# EAGLE design TMMOD-BREAKOUT-v1_1 (EAGLE 9.7.0)
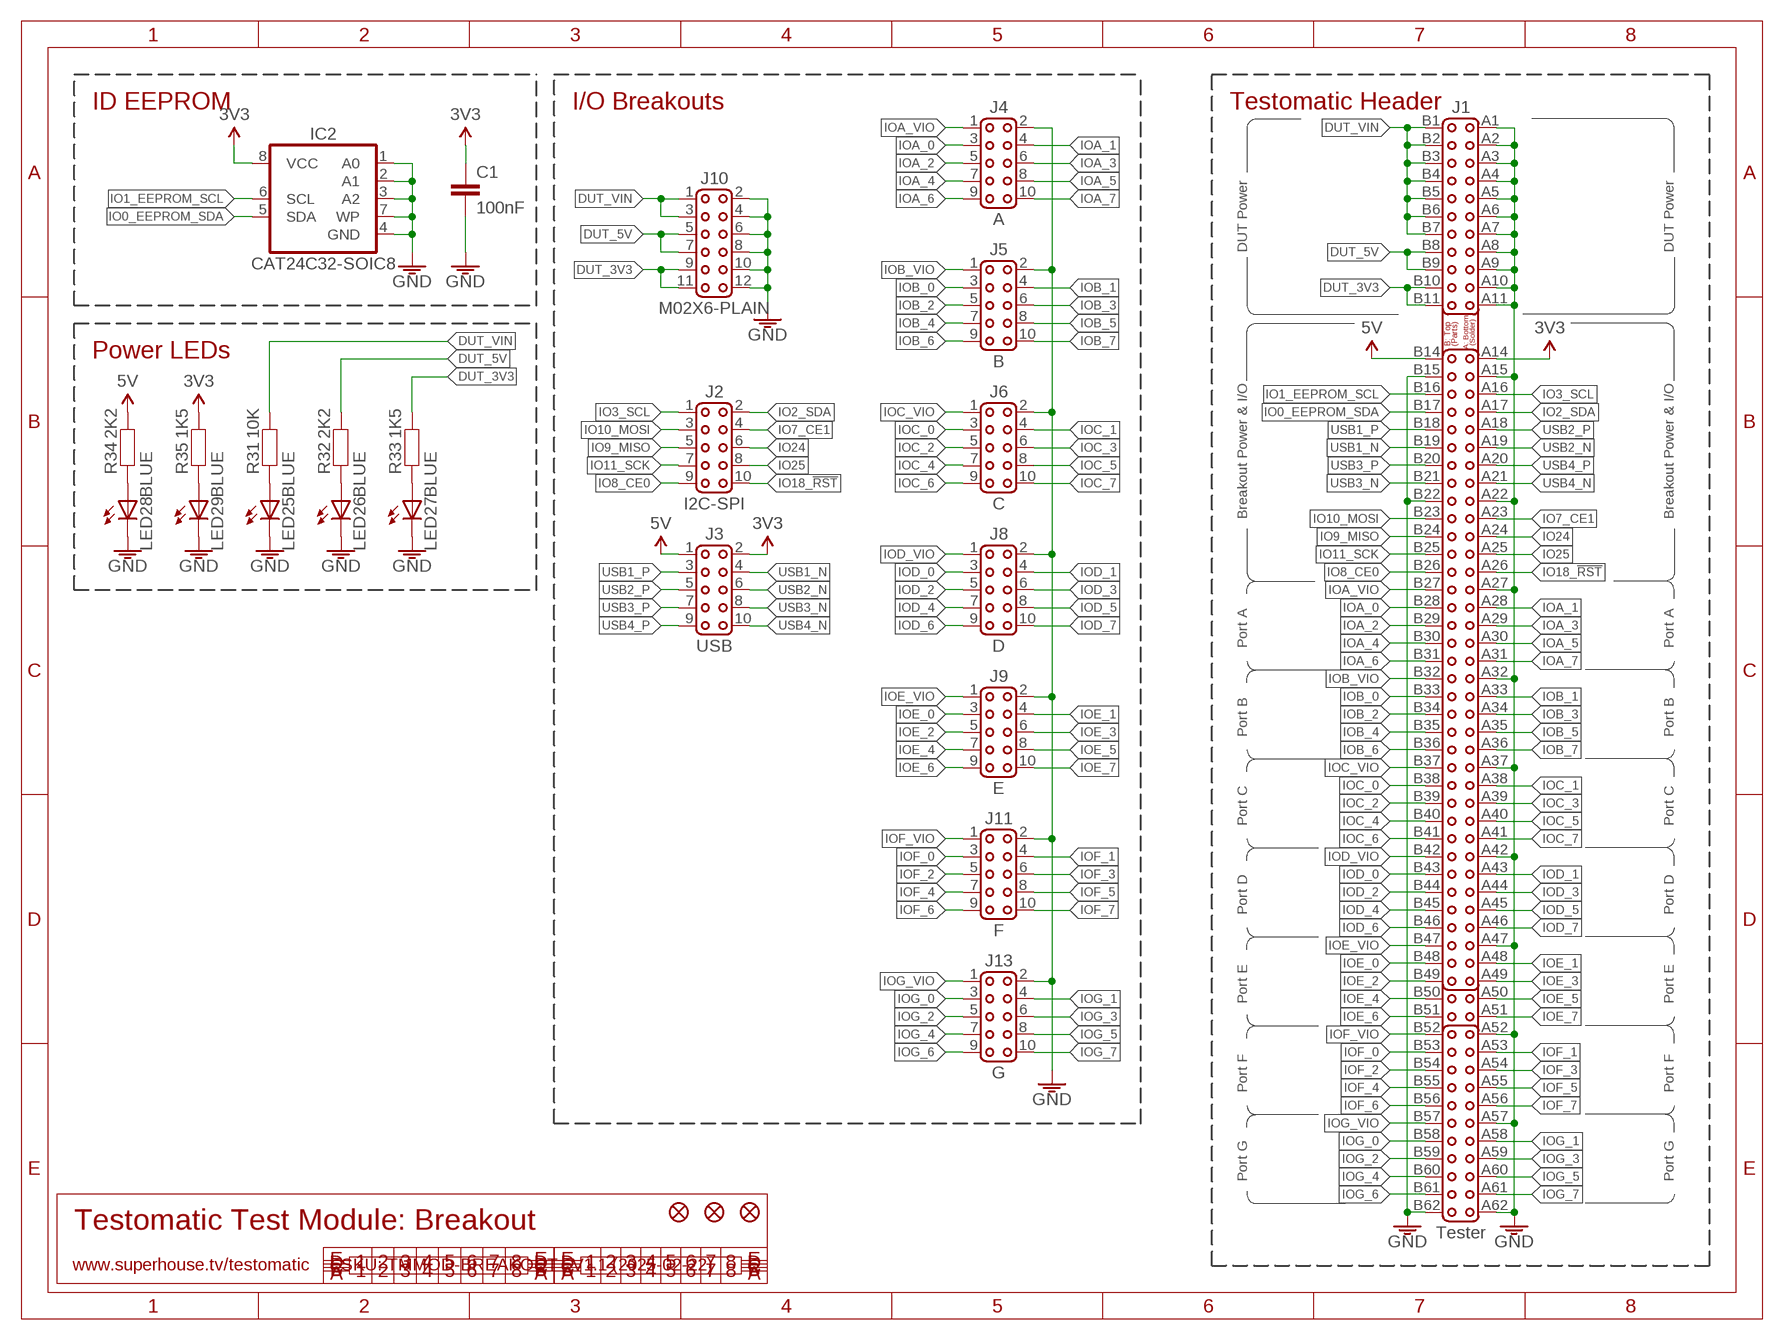
[diagram p0: schematic, sheet 1]

## Parts
C1  100nF  CAP0603  [C0603]
FID1  FIDUCIAL1X2.5  [FIDUCIAL-1X2.5]
FID2  FIDUCIAL1X2.5  [FIDUCIAL-1X2.5]
FID3  FIDUCIAL1X2.5  [FIDUCIAL-1X2.5]
IC2  CAT24C32-SOIC8  [SOIC8]
J1  Tester  PCI-CARD  [PCI-CARD]
J2  I2C-SPI  M02X5-PLAIN  [2X05-2.54-PLAIN]
J3  USB  M02X5-PLAIN  [2X05-2.54-PLAIN]
J4  A  M02X5-PLAIN  [2X05-2.54-PLAIN]
J5  B  M02X5-PLAIN  [2X05-2.54-PLAIN]
J6  C  M02X5-PLAIN  [2X05-2.54-PLAIN]
J8  D  M02X5-PLAIN  [2X05-2.54-PLAIN]
J9  E  M02X5-PLAIN  [2X05-2.54-PLAIN]
J10  M02X6-PLAIN  [2X06]
J11  F  M02X5-PLAIN  [2X05-2.54-PLAIN]
J13  G  M02X5-PLAIN  [2X05-2.54-PLAIN]
LED25  BLUE  LED0603  [LED-0603]
LED26  BLUE  LED0603  [LED-0603]
LED27  BLUE  LED0603  [LED-0603]
LED28  BLUE  LED0603  [LED-0603]
LED29  BLUE  LED0603  [LED-0603]
R31  10K  RESISTOR0603  [R0603]
R32  2K2  RESISTOR0603  [R0603]
R33  1K5  RESISTOR0603  [R0603]
R34  2K2  RESISTOR0603  [R0603]
R35  1K5  RESISTOR0603  [R0603]

## Nets
3.3V: C1.1 IC2.8(VCC) J1.A14 J3.2 R35.2
5V: J1.B14 J3.1 R34.2
DUT_3V3: J1.B10 J1.B11 J10.9 J10.11 R33.2
DUT_5V: J1.B8 J1.B9 J10.5 J10.7 R32.2
DUT_VIN: J1.B1 J1.B2 J1.B3 J1.B4 J1.B5 J1.B6 J1.B7 J10.1 J10.3 R31.2
GND: C1.2 IC2.1(A0) IC2.2(A1) IC2.3(A2) IC2.4(GND) IC2.7(WP) J1.A1 J1.A2 J1.A3 J1.A4 J1.A5 J1.A6 J1.A7 J1.A8 J1.A9 J1.A10 J1.A11 J1.A15 J1.A22 J1.A27 J1.A32 J1.A37 J1.A42 J1.A47 J1.A52 J1.A57 J1.A62 J1.B15 J1.B22 J1.B62 J4.2 J5.2 J6.2 J8.2 J9.2 J10.2 J10.4 J10.6 J10.8 J10.10 J10.12 J11.2 J13.2 LED25.C LED26.C LED27.C LED28.C LED29.C
IO0_EEPROM_SDA: IC2.5(SDA) J1.B17
IO1_EEPROM_SCL: IC2.6(SCL) J1.B16
IO2_SDA: J1.A17 J2.2
IO3_SCL: J1.A16 J2.1
IO7_CE1: J1.A23 J2.4
IO8_CE0: J1.B26 J2.9
IO9_MISO: J1.B24 J2.5
IO10_MOSI: J1.B23 J2.3
IO11_SCK: J1.B25 J2.7
IO18_!RST: J1.A26 J2.10
IO24: J1.A24 J2.6
IO25: J1.A25 J2.8
IOA_0: J1.B28 J4.3
IOA_1: J1.A28 J4.4
IOA_2: J1.B29 J4.5
IOA_3: J1.A29 J4.6
IOA_4: J1.B30 J4.7
IOA_5: J1.A30 J4.8
IOA_6: J1.B31 J4.9
IOA_7: J1.A31 J4.10
IOA_VIO: J1.B27 J4.1
IOB_0: J1.B33 J5.3
IOB_1: J1.A33 J5.4
IOB_2: J1.B34 J5.5
IOB_3: J1.A34 J5.6
IOB_4: J1.B35 J5.7
IOB_5: J1.A35 J5.8
IOB_6: J1.B36 J5.9
IOB_7: J1.A36 J5.10
IOB_VIO: J1.B32 J5.1
IOC_0: J1.B38 J6.3
IOC_1: J1.A38 J6.4
IOC_2: J1.B39 J6.5
IOC_3: J1.A39 J6.6
IOC_4: J1.B40 J6.7
IOC_5: J1.A40 J6.8
IOC_6: J1.B41 J6.9
IOC_7: J1.A41 J6.10
IOC_VIO: J1.B37 J6.1
IOD_0: J1.B43 J8.3
IOD_1: J1.A43 J8.4
IOD_2: J1.B44 J8.5
IOD_3: J1.A44 J8.6
IOD_4: J1.B45 J8.7
IOD_5: J1.A45 J8.8
IOD_6: J1.B46 J8.9
IOD_7: J1.A46 J8.10
IOD_VIO: J1.B42 J8.1
IOE_0: J1.B48 J9.3
IOE_1: J1.A48 J9.4
IOE_2: J1.B49 J9.5
IOE_3: J1.A49 J9.6
IOE_4: J1.B50 J9.7
IOE_5: J1.A50 J9.8
IOE_6: J1.B51 J9.9
IOE_7: J1.A51 J9.10
IOE_VIO: J1.B47 J9.1
IOF_0: J1.B53 J11.3
IOF_1: J1.A53 J11.4
IOF_2: J1.B54 J11.5
IOF_3: J1.A54 J11.6
IOF_4: J1.B55 J11.7
IOF_5: J1.A55 J11.8
IOF_6: J1.B56 J11.9
IOF_7: J1.A56 J11.10
IOF_VIO: J1.B52 J11.1
IOG_0: J1.B58 J13.3
IOG_1: J1.A58 J13.4
IOG_2: J1.B59 J13.5
IOG_3: J1.A59 J13.6
IOG_4: J1.B60 J13.7
IOG_5: J1.A60 J13.8
IOG_6: J1.B61 J13.9
IOG_7: J1.A61 J13.10
IOG_VIO: J1.B57 J13.1
N$25: LED25.A R31.1
N$26: LED28.A R34.1
N$27: LED26.A R32.1
N$28: LED27.A R33.1
N$29: LED29.A R35.1
USB1_N: J1.B19 J3.4
USB1_P: J1.B18 J3.3
USB2_N: J1.A19 J3.6
USB2_P: J1.A18 J3.5
USB3_N: J1.B21 J3.8
USB3_P: J1.B20 J3.7
USB4_N: J1.A21 J3.10
USB4_P: J1.A20 J3.9

## Notes on the sheet
- ID EEPROM | I/O Breakouts | Testomatic Header
- DUT Power | DUT Power
- Power LEDs
- Breakout Power & I/O | Breakout Power & I/O
- Port A | Port A
- Port B | Port B
- Port C | Port C
- Port D | Port D
- Port E | Port E
- Port F | Port F
- Port G | Port G
- Testomatic Test Module: Breakout
- www.superhouse.tv/testomatic | SKU: TMMOD-BREAKOUT | V1.1 (2025-02-22)

## Library data of the parts
C1 = SuperHouse-Capacitors:CAP: Capacitor Standard ceramic capacitor
FID1-FID3 = SuperHouse-Symbols:FIDUCIAL: Fiducial Alignment Points Various fiducial points for machine vision alignment.
IC2 = SuperHouse-ICs:CAT24C32
J1 = SuperHouse-Connectors:PCI
J2-J6 J8 J9 J11 J13 = SuperHouse-Connectors:M02X5: M10 header in 2x5 format
J10 = SuperHouse-Connectors:M02X6: M12 header in 2x6 format
LED25-LED29 = SuperHouse-LEDs:LED: LEDs in various sizes including 5mm and 3mm PTH, and 0402, 0603, 0805, etc SMT
R31-R35 = SuperHouse-Resistors:RESISTOR: Resistors in both surface-mount and through-hole versions.

## Net classes
0 Default: width 0.203 mm
2 gnd: width 0.152 mm, drill 0.305 mm, clearance 0.152 mm

## Board
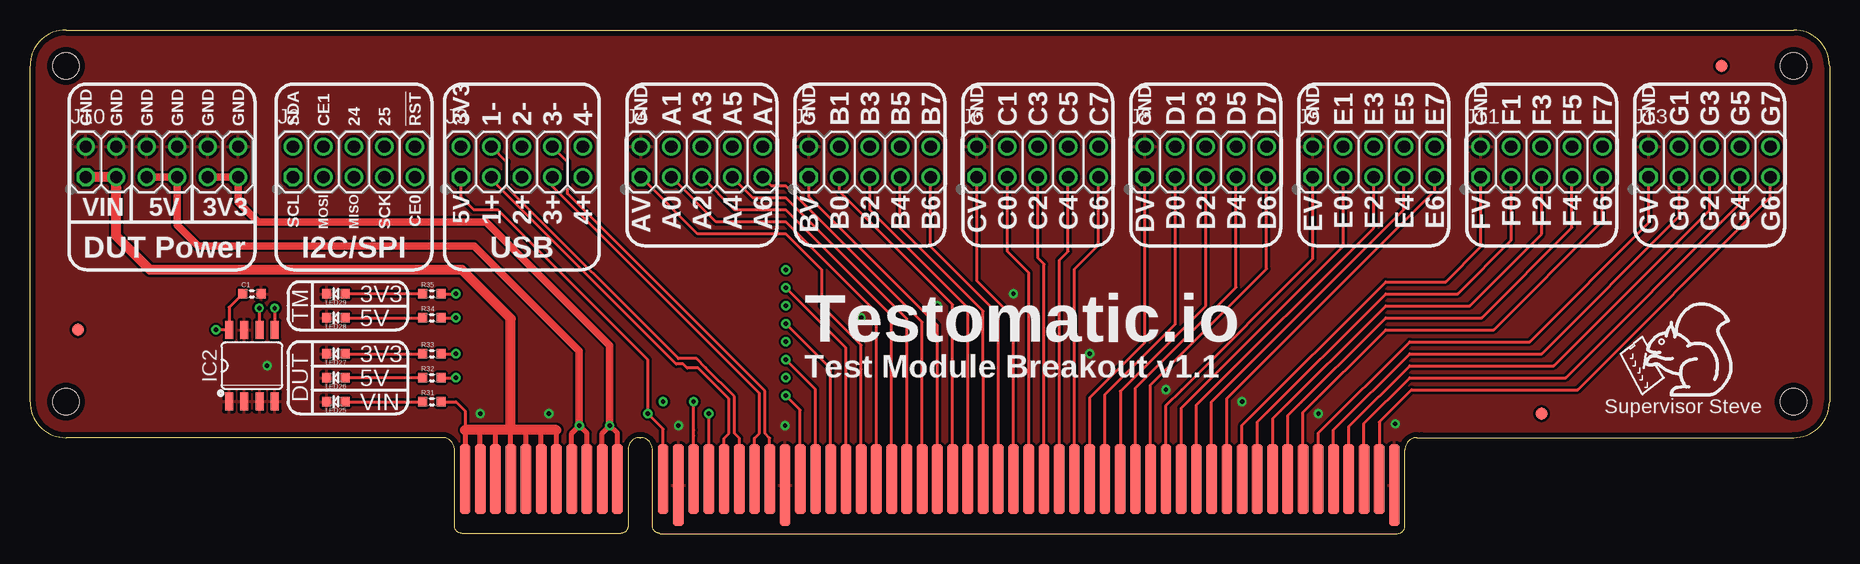
[diagram p1: board, top side]
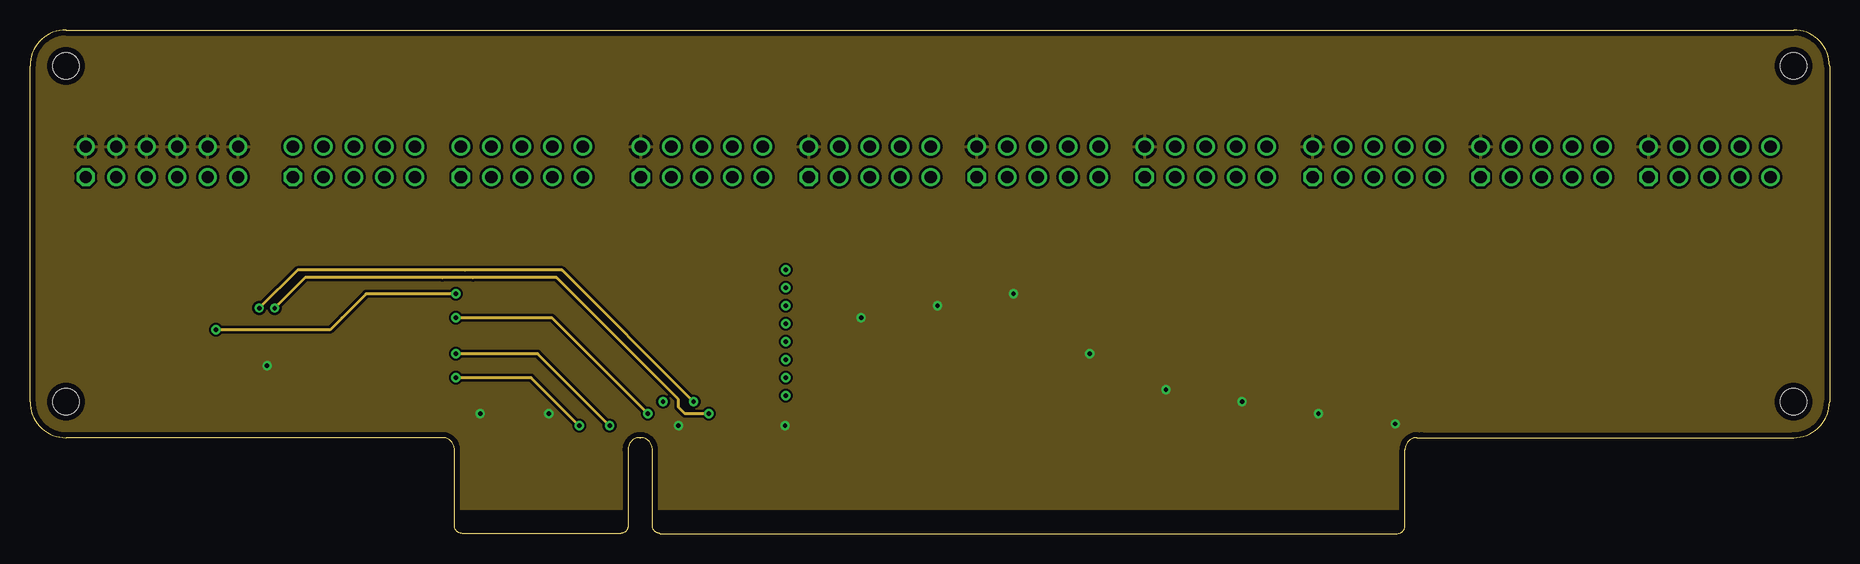
[diagram p2: board, inner layer Route2]
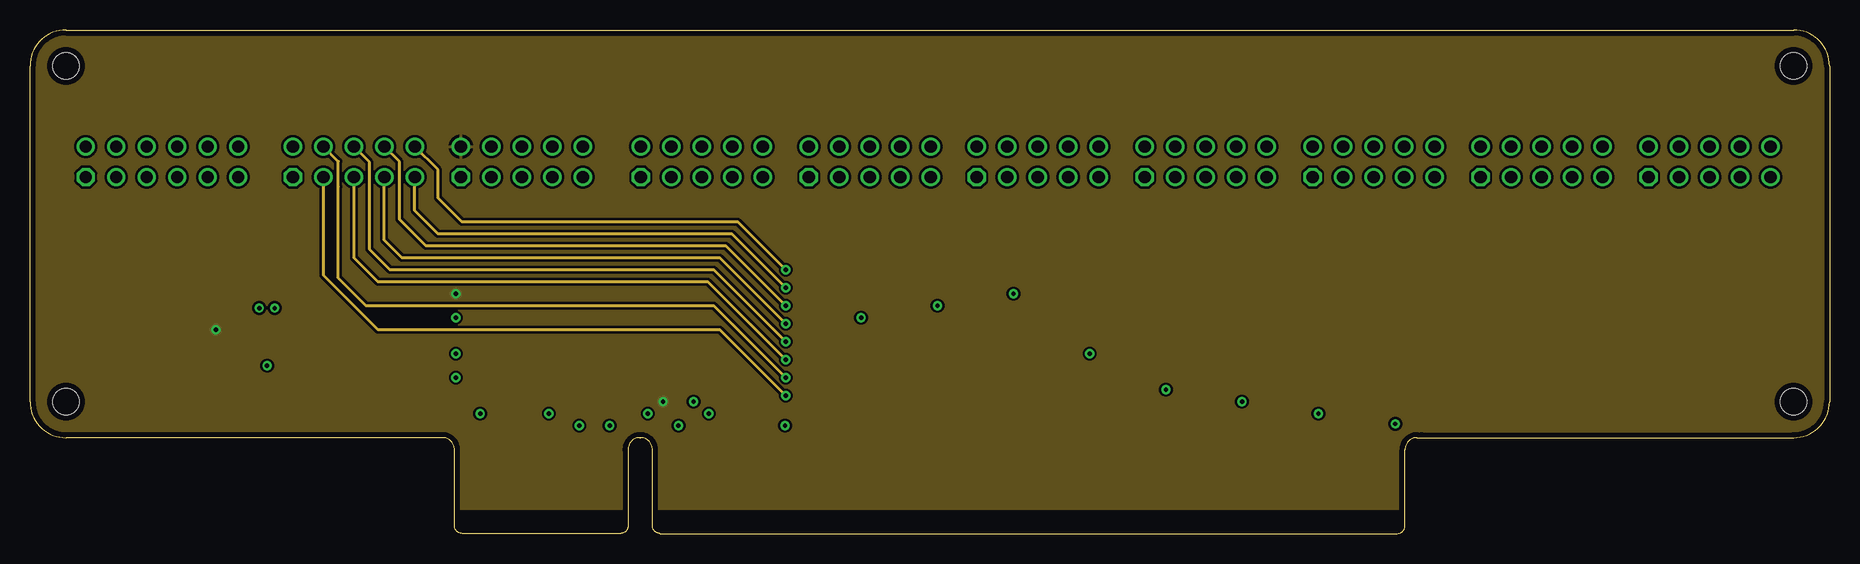
[diagram p3: board, inner layer Route15]
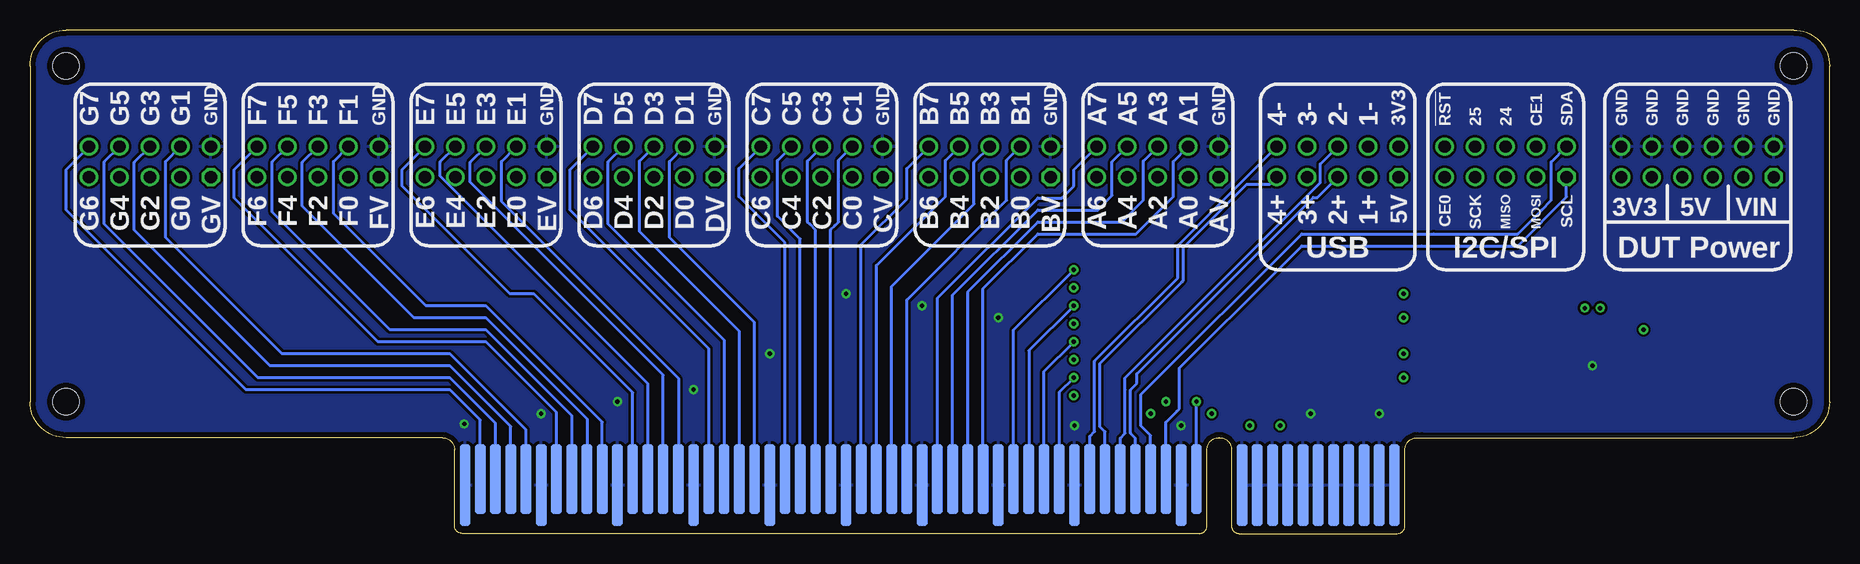
[diagram p4: board, bottom side, seen from below]

Size 150 x 42 mm. Coordinates in mm from the lower left corner, seen from the top.
Outline: 34,8 3,8 arc-90 0,11 0,39 arc-90 3,42 147,42 arc-90 150,39 150,11 arc-90 147,8 116,8
Copper layers (1+2*15+16): Top 0.035mm / dielectric 1.5mm / Route2 0.035mm / dielectric 0.15mm / Route15 0.035mm / dielectric 0.2mm / Bottom 0.035mm
Design rules "SuperHouse-Design-Rules *": minimum track width 10mil, minimum drill 24mil, track to track 8mil, track to pad 8mil, pad to pad 8mil, via to via 8mil, smd to smd 6mil, copper to edge 18mil, drill to drill 8mil, minimum pad ring 7mil, minimum via ring 8mil, stop-mask expansion 4mil, vias tented up to drill 0.5mm, thermal gap 10mil
Holes 2.2 mm at 147,11 3,11 3,39 147,39

### Footprints (pad centres in the part's own frame; a part is rotated, then mirrored left to right if it is on the bottom)
C0603 = smd 0.762 x 0.762: 1 -0.762,0; 2 0.762,0
FIDUCIAL-1X2.5 = smd 1 x 1: 1 0,0
SOIC8 = smd 1.524 x 0.66: 1 -2.973,1.905; 2 -2.973,0.635; 3 -2.973,-0.635; 4 -2.973,-1.905; 5 2.973,-1.905; 6 2.973,-0.635; 7 2.973,0.635; 8 2.973,1.905
PCI-CARD = smd 0.9 x 6.8 bottom: A1 -38.735,4.04; A2 -37.465,4.04; A3 -36.195,4.04; A4 -34.925,4.04; A5 -33.655,4.04; A6 -32.385,4.04; A7 -31.115,4.04; A8 -29.845,4.04; A9 -28.575,4.04; A10 -27.305,4.04; A11 -26.035,4.04; A15 -20.955,4.04; A22 -12.065,4.04; A27 -5.715,4.04; A32 0.635,4.04; A37 6.985,4.04; A42 13.335,4.04; A47 19.685,4.04; A52 26.035,4.04; A57 32.385,4.04; A62 38.735,4.04 | smd 0.9 x 5.8 bottom: A14 -22.225,4.54; A16 -19.685,4.54; A17 -18.415,4.54; A18 -17.145,4.54; A19 -15.875,4.54; A20 -14.605,4.54; A21 -13.335,4.54; A23 -10.795,4.54; A24 -9.525,4.54; A25 -8.255,4.54; A26 -6.985,4.54; A28 -4.445,4.54; A29 -3.175,4.54; A30 -1.905,4.54; A31 -0.635,4.54; A33 1.905,4.54; A34 3.175,4.54; A35 4.445,4.54; A36 5.715,4.54; A38 8.255,4.54; A39 9.525,4.54; A40 10.795,4.54; A41 12.065,4.54; A43 14.605,4.54; A44 15.875,4.54; A45 17.145,4.54; A46 18.415,4.54; A48 20.955,4.54; A49 22.225,4.54; A50 23.495,4.54; A51 24.765,4.54; A53 27.305,4.54; A54 28.575,4.54; A55 29.845,4.54; A56 31.115,4.54; A58 33.655,4.54; A59 34.925,4.54; A60 36.195,4.54; A61 37.465,4.54 | smd 0.9 x 5.8: B1 -38.735,4.54; B2 -37.465,4.54; B3 -36.195,4.54; B4 -34.925,4.54; B5 -33.655,4.54; B6 -32.385,4.54; B7 -31.115,4.54; B8 -29.845,4.54; B9 -28.575,4.54; B10 -27.305,4.54; B11 -26.035,4.54; B14 -22.225,4.54; B16 -19.685,4.54; B17 -18.415,4.54; B18 -17.145,4.54; B19 -15.875,4.54; B20 -14.605,4.54; B21 -13.335,4.54; B23 -10.795,4.54; B24 -9.525,4.54; B25 -8.255,4.54; B26 -6.985,4.54; B27 -5.715,4.54; B28 -4.445,4.54; B29 -3.175,4.54; B30 -1.905,4.54; B31 -0.635,4.54; B32 0.635,4.54; B33 1.905,4.54; B34 3.175,4.54; B35 4.445,4.54; B36 5.715,4.54; B37 6.985,4.54; B38 8.255,4.54; B39 9.525,4.54; B40 10.795,4.54; B41 12.065,4.54; B42 13.335,4.54; B43 14.605,4.54; B44 15.875,4.54; B45 17.145,4.54; B46 18.415,4.54; B47 19.685,4.54; B48 20.955,4.54; B49 22.225,4.54; B50 23.495,4.54; B51 24.765,4.54; B52 26.035,4.54; B53 27.305,4.54; B54 28.575,4.54; B55 29.845,4.54; B56 31.115,4.54; B57 32.385,4.54; B58 33.655,4.54; B59 34.925,4.54; B60 36.195,4.54; B61 37.465,4.54 | smd 0.9 x 6.8: B15 -20.955,4.04; B22 -12.065,4.04; B62 38.735,4.04
2X05-2.54-PLAIN = drill 1.016 octagon: 1 -5.08,-1.27 | drill 1.016: 2 -5.08,1.27; 3 -2.54,-1.27; 4 -2.54,1.27; 5 0,-1.27; 6 0,1.27; 7 2.54,-1.27; 8 2.54,1.27; 9 5.08,-1.27; 10 5.08,1.27
2X06 = drill 1.016 octagon: 1 -6.35,-1.27 | drill 1.016: 2 -6.35,1.27; 3 -3.81,-1.27; 4 -3.81,1.27; 5 -1.27,-1.27; 6 -1.27,1.27; 7 1.27,-1.27; 8 1.27,1.27; 9 3.81,-1.27; 10 3.81,1.27; 11 6.35,-1.27; 12 6.35,1.27
LED-0603 = smd 0.762 x 0.762: A -0.762,0; C 0.762,0
R0603 = smd 0.762 x 0.762: 1 -0.762,0; 2 0.762,0

### Placement (x,y rotation side)
C1  18.5,20 0 top
FID1  4,17 270 top
FID2  141,39 270 top
FID3  126,10 270 top
IC2  18.5,14 90 top
J1  75,0 0 top
J2  27,31 0 top
J3  41,31 0 top
J4  56,31 0 top
J5  70,31 0 top
J6  84,31 0 top
J8  98,31 0 top
J9  112,31 0 top
J10  11,31 0 top
J11  126,31 0 top
J13  140,31 0 top
LED25  25.5,11 180 top
LED26  25.5,13 180 top
LED27  25.5,15 180 top
LED28  25.5,18 180 top
LED29  25.5,20 180 top
R31  33.5,11 0 top
R32  33.5,13 0 top
R33  33.5,15 0 top
R34  33.5,18 0 top
R35  33.5,20 0 top

### Tracks (layer width: path | path; a pad name or v marks a point on that pad's centre or on a via)
3.3V  (via drill 0.35)
  Top 0.254: R35.2 v35.5,20 | v15.5,17 15.53,16.97 IC2.8 16.59,18.86 C1.1
  Route2 0.254: v35.5,20 28,20 26,18 25,17 20,17 18,17 v15.5,17
  Bottom 0.254: J1.A14 52.77,9.09 v52.77,11
  pour Route15: 0.08,2.08 149.92,2.08 149.92,41.92 0.08,41.92
5V  (via drill 0.35)
  Top 0.254: J1.B14 52.77,8.72 v51.5,10 51.5,14.5 47.92,18.08 39,27 38,27 37,27 35.92,28.08 J3.1 | R34.2 v35.5,18
  Route2 0.254: v51.5,10 43.5,18 v35.5,18
DUT_3V3  (via drill 0.35)
  Top 0.254: R33.2 v35.5,15
  Top 0.406: J1.B10 47.7,8.37 v48.33,9 48.97,8.37 J1.B11
  Top 0.61: J10.9 J10.11 17.35,27.65 19,26 31,26 38,26 48.33,15.67 v48.33,9
  Route2 0.254: v48.33,9 42.33,15 v35.5,15
DUT_5V  (via drill 0.35)
  Top 0.254: R32.2 v35.5,13
  Top 0.406: J1.B8 45.16,8.37 v45.79,9 46.42,8.37 J1.B9
  Top 0.61: v45.79,9 45.79,15.21 37,24 30,24 28,24 14,24 12.27,25.73 J10.7 J10.5
  Route2 0.254: v45.79,9 41.79,13 v35.5,13
DUT_VIN
  Top 0.254: R31.2 35.5,11 36.27,10.23 36.27,8.63
  Top 0.406: 36.27,8.63 J1.B1 | J1.B7 43.89,8.63 | J1.B2 37.53,8.63 | J1.B3 38.8,8.63 | J1.B4 40.08,8.63 | J1.B5 41.34,8.63 | J1.B6 42.62,8.63
  Top 0.813: 43.89,8.63 42.62,8.63 41.34,8.63 40.08,8.63 | 40.08,8.63 38.8,8.63 37.53,8.63 36.27,8.63 | 40.08,8.63 40.08,17.93 36,22 26,22 10,22 9,23 7.19,24.81 7.19,28.81 J10.3 J10.1
GND  (via drill 0.35)
  other vias: 19.76,14 81.98,20 75.64,19 62.94,9 54.05,9 88.34,15 94.69,12 101.03,11 107.38,10 37.53,10 43.25,10 113.8,9.15 69.28,18
  pour Top: 0.08,2.08 149.92,2.08 149.92,41.92 0.08,41.92
  pour Bottom: 0.08,2.08 149.92,2.08 149.92,41.92 0.08,41.92
  pour Route2: 0.08,2.08 149.92,2.08 149.92,41.92 0.08,41.92
IO0_EEPROM_SDA  (via drill 0.35)
  Top 0.254: J1.B17 56.59,8.09 56.59,8.63 v56.59,10 | v20.39,18.8 20.39,16.99 IC2.5
  Route2 0.254: v56.59,10 54.59,10 54.05,10.54 54.05,11.18 43.89,21.34 36.9,21.34 34.36,21.34 22.93,21.34 v20.39,18.8
IO1_EEPROM_SCL  (via drill 0.35)
  Top 0.254: J1.B16 55.31,8.19 55.31,8.63 v55.31,11 | v19.12,18.8 19.12,16.99 IC2.6
  Route2 0.254: v55.31,11 44.34,21.97 36.27,21.97 22.3,21.97 v19.12,18.8
IO2_SDA
  Bottom 0.254: J1.A17 56.59,8.19 57.4,9 57.4,11.6 44,25 33,25 26,25 24,27 23.2,27.8 23.2,29.1 23.2,30.99 J2.2
IO3_SCL
  Bottom 0.254: J1.A16 55.31,9.29 54.4,10.2 54.2,10.4 54.2,12 54.2,13.8 46,22 44,24 34,24 26,24 21.92,28.08 J2.1
IO7_CE1  (via drill 0.35)
  Route15 0.254: v63,13 57,19 48,19 28,19 27,20 26,21 25.7,21.3 25.7,28.9 25.7,31.03 J2.4
  Bottom 0.254: J1.A23 64.2,11.79 v63,13
IO8_CE0  (via drill 0.35)
  Top 0.254: J1.B26 68.02,15.48 v63,20.5
  Route15 0.254: v63,20.5 59,24.5 58.5,25 55,25 34,25 32.08,26.92 J2.9
IO9_MISO  (via drill 0.35)
  Top 0.254: J1.B24 65.47,12.03 v63,14.5
  Route15 0.254: v63,14.5 57,20.5 56.5,21 47,21 29,21 27,23 J2.5
IO10_MOSI  (via drill 0.35)
  Top 0.254: J1.B23 64.2,10.29 v63,11.5
  Route15 0.254: v63,11.5 57.5,17 50,17 29,17 26,20 24.46,21.54 J2.3
IO11_SCK  (via drill 0.35)
  Top 0.254: J1.B25 66.75,13.76 v63,17.5
  Route15 0.254: v63,17.5 59,21.5 57.5,23 55,23 31,23 29.54,24.46 J2.7
IO18_!RST  (via drill 0.35)
  Route15 0.254: v63,22 59,26 49,26 36,26 34,28 34,30 34,30.35 J2.10
  Bottom 0.254: J1.A26 68.02,16.98 v63,22
IO24  (via drill 0.35)
  Route15 0.254: v63,16 57,22 47,22 31,22 30,22 29,23 28.3,23.7 28.3,29.1 28.3,30.97 J2.6
  Bottom 0.254: J1.A24 65.47,13.53 v63,16
IO25  (via drill 0.35)
  Route15 0.254: v63,19 59,23 58,24 56,24 36,24 33,24 32,25 31,26 30.8,26.2 30.8,29.2 30.8,31.01 J2.8
  Bottom 0.254: J1.A25 66.75,15.26 v63,19
IOA_0
  Top 0.254: J1.B28 70.56,12.45 70.56,18.45 66,23 63,26 61,26 57.19,26 J4.3
IOA_1
  Bottom 0.254: J1.A28 70.56,20.45 66,25 57.8,25 54.7,28.1 54.7,31.03 J4.4
IOA_2
  Top 0.254: J1.B29 71.83,18.18 63,27 58.73,27 J4.5
IOA_3
  Bottom 0.254: J1.A29 71.83,20.18 66,26 59,26 57.2,27.8 57.2,31.07 J4.6
IOA_4
  Top 0.254: J1.B30 73.09,17.91 63,28 60.27,28 J4.7
IOA_5
  Bottom 0.254: J1.A30 73.09,19.91 66,27 61,27 59.8,28.2 59.8,31.01 J4.8
IOA_6
  Top 0.254: J1.B31 74.36,17.64 63,29 61.81,29 J4.9
IOA_7
  Bottom 0.254: J1.A31 74.36,19.64 66,28 64,28 63,29 63,30.35 J4.10
IOA_VIO
  Top 0.254: J1.B27 69.28,13.71 69.28,15.71 68,17 66,19 66,21 66,22 64,24 63,25 60,25 55.65,25 J4.1
IOB_0
  Top 0.254: J1.B33 76.91,19.09 67.46,28.54 J5.3
IOB_1
  Bottom 0.254: J1.A33 76.91,19.5 68.6,27.8 68.6,31.13 J5.4
IOB_2
  Top 0.254: J1.B34 78.17,18.82 70,27 J5.5
IOB_3
  Bottom 0.254: J1.A34 78.17,20.62 71.3,27.5 71.3,30.97 J5.6
IOB_4
  Top 0.254: J1.B35 79.44,13 79.44,13.1 79.44,18.55 72.54,25.46 J5.7
IOB_5
  Bottom 0.254: J1.A35 79.44,22.36 73.7,28.1 73.7,31.11 J5.8
IOB_6
  Top 0.254: J1.B36 80.72,18.29 75.08,23.92 J5.9
IOB_7
  Bottom 0.254: J1.A36 80.72,24.09 76.9,27.9 76.9,30.45 J5.10
IOB_VIO
  Top 0.254: J1.B32 75.64,17.36 74,19 64.92,28.08 J5.1
IOC_0
  Top 0.254: J1.B38 83.25,21.75 81.46,23.54 J6.3
IOC_1
  Bottom 0.254: J1.A38 83.25,25.34 82.9,25.7 82.6,26 82.6,29.4 82.6,31.13 J6.4
IOC_2
  Top 0.254: J1.B39 84.53,22.48 84,23 J6.5
IOC_3
  Bottom 0.254: J1.A39 84.53,25.32 85,25.8 85.2,26 85.2,29.4 85.2,31.07 J6.6
IOC_4
  Top 0.254: J1.B40 85.8,22.8 86.54,23.54 J6.7
IOC_5
  Bottom 0.254: J1.A40 85.8,24.57 87.7,26.48 87.7,31.11 J6.8
IOC_6
  Top 0.254: J1.B41 87.06,22.07 89.08,24.08 J6.9
IOC_7
  Bottom 0.254: J1.A41 87.06,24.25 90.9,28.09 90.9,30.45 J6.10
IOC_VIO
  Top 0.254: J1.B37 81.98,18.02 81,19 78.92,21.08 J6.1
IOD_0
  Top 0.254: J1.B43 89.61,11.61 95.46,17.46 J8.3
IOD_1
  Bottom 0.254: J1.A43 89.61,17.61 96.7,24.7 96.7,31.03 J8.4
IOD_2
  Top 0.254: J1.B44 90.88,11.88 98,19 J8.5
IOD_3
  Bottom 0.254: J1.A44 90.88,16.88 99.2,25.2 99.2,31.07 J8.6
IOD_4
  Top 0.254: J1.B45 92.14,12.14 100.54,20.54 J8.7
IOD_5
  Bottom 0.254: J1.A45 92.14,16.14 101.8,25.8 101.8,31.01 J8.8
IOD_6
  Top 0.254: J1.B46 93.41,12.41 103.08,22.08 J8.9
IOD_7
  Bottom 0.254: J1.A46 93.41,15.41 105,27 105,30.35 J8.10
IOD_VIO
  Top 0.254: J1.B42 88.34,11.34 92.92,15.92 J8.1
IOE_0
  Top 0.254: J1.B48 95.95,10.46 109.46,23.96 J9.3
IOE_1
  Bottom 0.254: J1.A48 95.95,12.96 110.7,27.7 110.7,31.03 J9.4
IOE_2
  Top 0.254: J1.B49 97.22,10.72 112,25.5 J9.5
IOE_3
  Bottom 0.254: J1.A49 97.22,13.22 113.3,29.3 113.3,30.97 J9.6
IOE_4
  Top 0.254: J1.B50 98.5,10.99 114.54,27.04 J9.7
IOE_5
  Bottom 0.254: J1.A50 98.5,12.49 115.8,29.8 115.8,31.01 J9.8
IOE_6
  Top 0.254: J1.B51 99.77,11.27 117.08,28.58 J9.9
IOE_7
  Bottom 0.254: J1.A51 99.77,11.77 108,20 110,20 119,29 119,30.35 J9.10
IOE_VIO
  Top 0.254: J1.B47 94.69,10.69 96,12 106.92,22.92 J9.1
IOF_0
  Top 0.254: J1.B53 102.31,9.3 113,20 119,20 123.46,24.46 J11.3
IOF_1
  Bottom 0.254: J1.A53 102.31,9.3 112,19 117,19 124.7,26.7 124.7,31.03 J11.4
IOF_2
  Top 0.254: J1.B54 103.58,9.57 113,19 120,19 126,25 J11.5
IOF_3
  Bottom 0.254: J1.A54 103.58,9.57 112,18 118,18 127.3,27.3 127.3,30.97 J11.6
IOF_4
  Top 0.254: J1.B55 104.84,9.85 113,18 121,18 128.54,25.54 J11.7
IOF_5
  Bottom 0.254: J1.A55 104.84,9.85 112,17 120,17 129.8,26.8 129.8,31.01 J11.8
IOF_6
  Top 0.254: J1.B56 106.11,10.12 113,17 122,17 131.08,26.08 J11.9
IOF_7
  Bottom 0.254: J1.A56 106.11,10.12 112,16 121,16 133,28 133,30.35 J11.10
IOF_VIO
  Top 0.254: J1.B52 101.03,9.04 113,21 118,21 120.92,23.92 J11.1
IOG_0
  Top 0.254: J1.B58 108.66,8.65 115,15 126,15 137.46,26.46 J13.3
IOG_1
  Bottom 0.254: J1.A58 108.66,8.65 115,15 129,15 138.7,24.7 138.7,31.03 J13.4
IOG_2
  Top 0.254: J1.B59 109.92,8.93 115,14 127,14 140,27 J13.5
IOG_3
  Bottom 0.254: J1.A59 109.92,8.93 115,14 130,14 141.3,25.3 141.3,30.97 J13.6
IOG_4
  Top 0.254: J1.B60 111.19,9.2 115,13 128,13 142.54,27.54 J13.7
IOG_5
  Bottom 0.254: J1.A60 111.19,9.2 115,13 131,13 143.8,25.8 143.8,31.01 J13.8
IOG_6
  Top 0.254: J1.B61 112.47,9.3 115.16,12 129,12 145.08,28.08 J13.9
IOG_7
  Bottom 0.254: J1.A61 112.47,9.46 115,12 132,12 147,27 147,30.35 J13.10
IOG_VIO
  Top 0.254: J1.B57 107.38,8.38 115,16 125,16 134.92,25.92 J13.1
N$25
  Top 0.254: LED25.A R31.1
N$26
  Top 0.254: LED28.A R34.1
N$27
  Top 0.254: R32.1 LED26.A
N$28
  Top 0.254: LED27.A R33.1
N$29
  Top 0.254: R35.1 LED29.A
USB1_N
  Top 0.254: J1.B19 59.12,7.95 58.72,8.35 58.72,11.43 56.32,13.82 55.56,14.58 54.05,14.58 39.73,28.91 39.73,31 J3.4
USB1_P
  Top 0.254: J1.B18 57.86,7.95 58.26,8.35 58.26,11.24 55.69,13.81 54.77,13.81 54.45,14.13 53.86,14.13 38.46,29.53 J3.3
USB2_N
  Bottom 0.254: J1.A19 59.12,7.95 58.72,8.35 58.72,12 58.72,12.99 42.44,29.27 42.44,30.83 J3.6
USB2_P
  Bottom 0.254: J1.A18 57.86,7.95 58.26,8.35 58.26,12 57.74,12.53 57.74,13.32 43.04,28.02 42.7,28.02 J3.5
USB3_N
  Top 0.254: J1.B21 61.66,7.95 61.26,8.35 61.26,11.89 59,14.15 44.81,28.34 44.81,31 J3.8
USB3_P
  Top 0.254: J1.B20 60.39,7.95 60.8,8.35 60.8,11.7 58.54,13.96 43.54,28.96 J3.7
USB4_N
  Bottom 0.254: J1.A21 61.66,8.11 61.26,8.52 61.26,14.39 54.32,21.32 54.32,24.03 J3.10
USB4_P
  Bottom 0.254: J3.9 46.64,29.17 46.68,29.13 48.57,29.13 53.87,23.84 53.87,21.13 54,21 60.8,14.2 60.8,8.89 60.39,8.48 J1.A20

### Text on the board
tPlace: GND | GND | GND | GND | GND | GND | SDA | CE1 | 24 | 25 | !RST | 3V3 | 1- | 2- | 3- | 4- | GND | A1 | A3 | A5 | A7 | GND | B1 | B3 | B5 | B7 | GND | C1 | C3 | C5 | C7 | GND | D1 | D3 | D5 | D7 | GND | E1 | E3 | E5 | E7 | GND | F1 | F3 | F5 | F7 | GND | G1 | G3 | G5 | G7 | SCL | MOSI | MISO | SCK | CE0 | 5V | 1+ | 2+ | 3+ | 4+ | AV | A0 | A2 | A4 | A6 | BV | B0 | B2 | B4 | B6 | CV | C0 | C2 | C4 | C6 | DV | D0 | D2 | D4 | D6 | EV | E0 | E2 | E4 | E6 | FV | F0 | F2 | F4 | F6 | GV | G0 | G2 | G4 | G6 | VIN | 5V | 3V3 | DUT Power | I2C/SPI | USB | 3V3 | TM | 5V | Testomatic.io | 3V3 | DUT | 5V | Test Module Breakout v1.1 | VIN | Supervisor Steve
bPlace: GND | GND | GND | GND | GND | GND | SDA | CE1 | 24 | 25 | !RST | 3V3 | 1- | 2- | 3- | 4- | GND | A1 | A3 | A5 | A7 | GND | B1 | B3 | B5 | B7 | GND | C1 | C3 | C5 | C7 | GND | D1 | D3 | D5 | D7 | GND | E1 | E3 | E5 | E7 | GND | F1 | F3 | F5 | F7 | GND | G1 | G3 | G5 | G7 | SCL | MOSI | MISO | SCK | CE0 | 5V | 1+ | 2+ | 3+ | 4+ | AV | A0 | A2 | A4 | A6 | BV | B0 | B2 | B4 | B6 | CV | C0 | C2 | C4 | C6 | DV | D0 | D2 | D4 | D6 | EV | E0 | E2 | E4 | E6 | FV | F0 | F2 | F4 | F6 | GV | G0 | G2 | G4 | G6 | VIN | 5V | 3V3 | DUT Power | I2C/SPI | USB